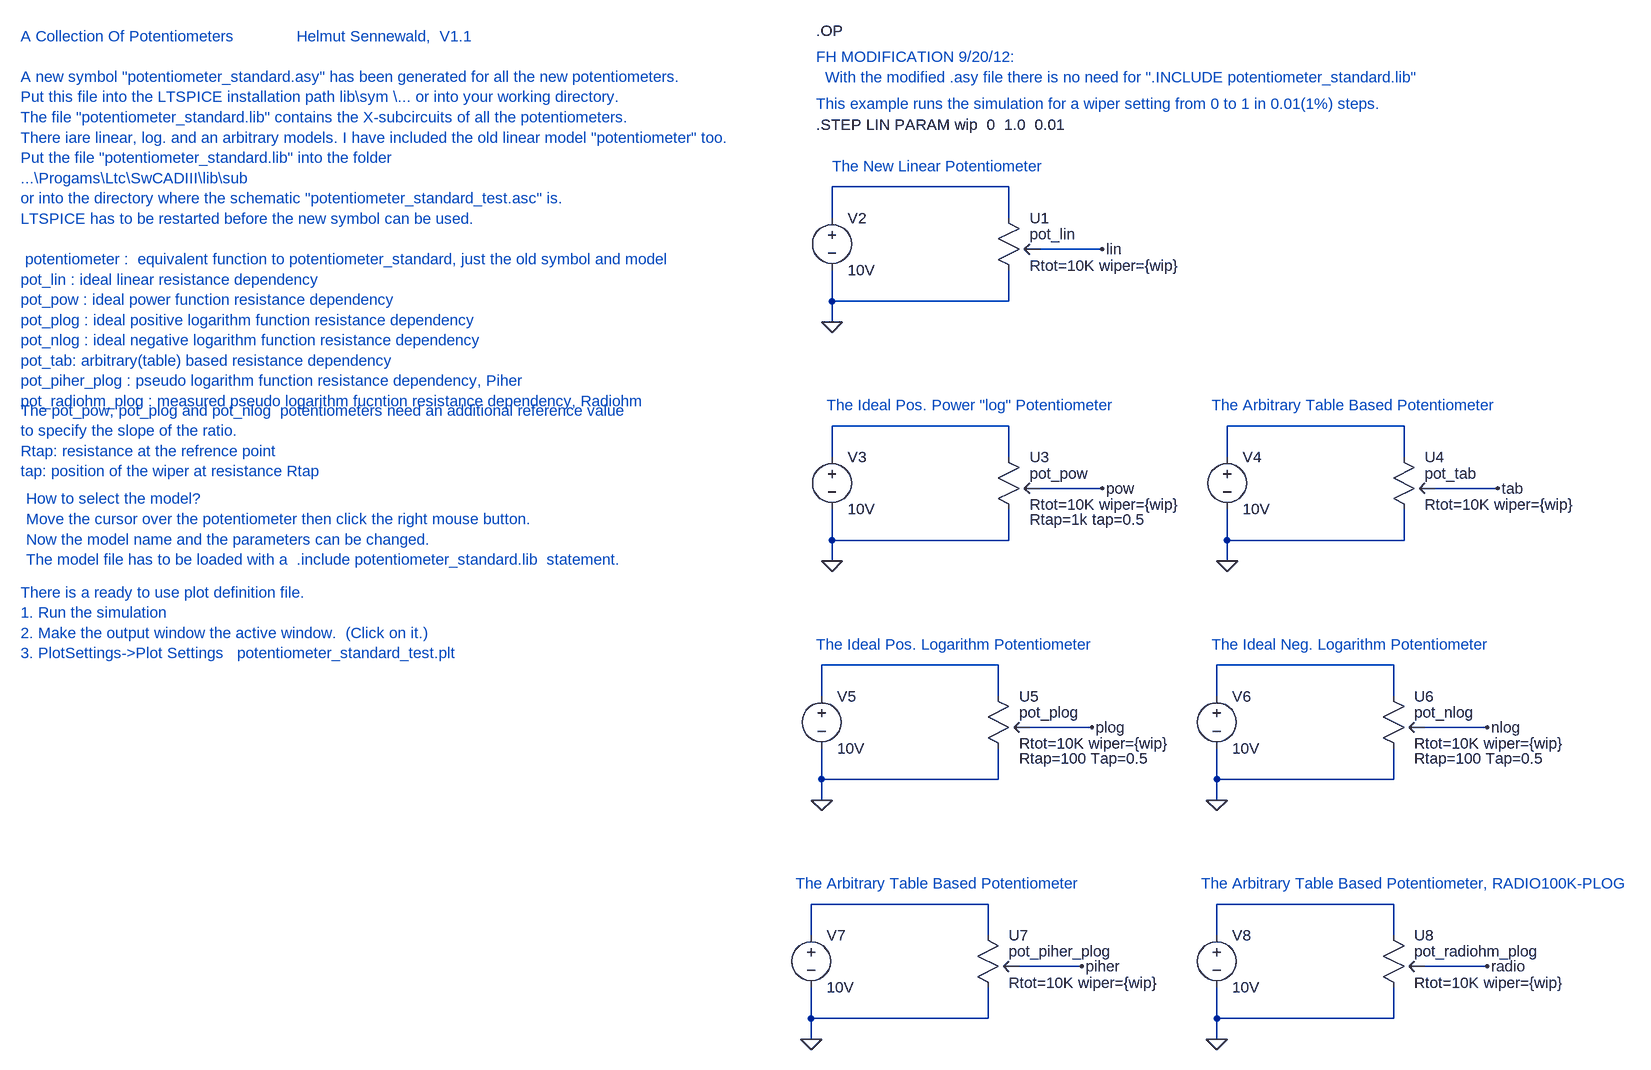
[diagram p0: schematic potentiometer_standard_test.asc]
potentiometer_standard_test.asc, the LTspice schematic file:
Version 4
SHEET 1 2288 3124
WIRE 384 1792 112 1792
WIRE 112 1840 112 1792
WIRE 384 1840 384 1792
WIRE 528 1888 432 1888
WIRE 112 1968 112 1920
WIRE 384 1968 384 1920
WIRE 384 1968 112 1968
WIRE 112 2000 112 1968
WIRE 384 2160 112 2160
WIRE 992 2160 720 2160
WIRE 112 2208 112 2160
WIRE 384 2208 384 2160
WIRE 720 2208 720 2160
WIRE 992 2208 992 2160
WIRE 528 2256 432 2256
WIRE 1136 2256 1040 2256
WIRE 112 2336 112 2288
WIRE 384 2336 384 2288
WIRE 384 2336 112 2336
WIRE 720 2336 720 2288
WIRE 992 2336 992 2288
WIRE 992 2336 720 2336
WIRE 112 2368 112 2336
WIRE 720 2368 720 2336
WIRE 368 2528 96 2528
WIRE 976 2528 704 2528
WIRE 96 2576 96 2528
WIRE 368 2576 368 2528
WIRE 704 2576 704 2528
WIRE 976 2576 976 2528
WIRE 512 2624 416 2624
WIRE 1120 2624 1024 2624
WIRE 96 2704 96 2656
WIRE 368 2704 368 2656
WIRE 368 2704 96 2704
WIRE 704 2704 704 2656
WIRE 976 2704 976 2656
WIRE 976 2704 704 2704
WIRE 96 2736 96 2704
WIRE 704 2736 704 2704
WIRE 352 2896 80 2896
WIRE 976 2896 704 2896
WIRE 80 2944 80 2896
WIRE 352 2944 352 2896
WIRE 704 2944 704 2896
WIRE 976 2944 976 2896
WIRE 496 2992 400 2992
WIRE 1120 2992 1024 2992
WIRE 80 3072 80 3024
WIRE 352 3072 352 3024
WIRE 352 3072 80 3072
WIRE 704 3072 704 3024
WIRE 976 3072 976 3024
WIRE 976 3072 704 3072
WIRE 80 3104 80 3072
WIRE 704 3104 704 3072
FLAG 528 1888 lin
FLAG 112 2000 0
FLAG 528 2256 pow
FLAG 112 2368 0
FLAG 1136 2256 tab
FLAG 720 2368 0
FLAG 512 2624 plog
FLAG 96 2736 0
FLAG 1120 2624 nlog
FLAG 704 2736 0
FLAG 496 2992 piher
FLAG 80 3104 0
FLAG 1120 2992 radio
FLAG 704 3104 0
SYMBOL VOLTAGE 112 1824 R0
SYMATTR InstName V2
SYMATTR Value 10V
SYMBOL VOLTAGE 112 2192 R0
SYMATTR InstName V3
SYMATTR Value 10V
SYMBOL VOLTAGE 720 2192 R0
SYMATTR InstName V4
SYMATTR Value 10V
SYMBOL VOLTAGE 96 2560 R0
SYMATTR InstName V5
SYMATTR Value 10V
SYMBOL VOLTAGE 704 2560 R0
SYMATTR InstName V6
SYMATTR Value 10V
SYMBOL VOLTAGE 80 2928 R0
SYMATTR InstName V7
SYMATTR Value 10V
SYMBOL VOLTAGE 704 2928 R0
SYMATTR InstName V8
SYMATTR Value 10V
SYMBOL potentiometer_standard 368 1824 R0
SYMATTR InstName U1
SYMATTR Value Rtot=10K wiper={wip}
SYMATTR SpiceLine ""
SYMBOL potentiometer_standard 368 2192 R0
SYMATTR InstName U3
SYMATTR Value Rtot=10K wiper={wip}
SYMATTR SpiceModel pot_pow
SYMBOL potentiometer_standard 976 2192 R0
SYMATTR InstName U4
SYMATTR Value Rtot=10K wiper={wip}
SYMATTR SpiceLine ""
SYMATTR SpiceModel pot_tab
SYMBOL potentiometer_standard 352 2560 R0
SYMATTR InstName U5
SYMATTR Value Rtot=10K wiper={wip}
SYMATTR SpiceLine Rtap=100 Tap=0.5
SYMATTR SpiceModel pot_plog
SYMBOL potentiometer_standard 960 2560 R0
SYMATTR InstName U6
SYMATTR Value Rtot=10K wiper={wip}
SYMATTR SpiceLine Rtap=100 Tap=0.5
SYMATTR SpiceModel pot_nlog
SYMBOL potentiometer_standard 336 2928 R0
SYMATTR InstName U7
SYMATTR Value Rtot=10K wiper={wip}
SYMATTR SpiceLine ""
SYMATTR SpiceModel pot_piher_plog
SYMBOL potentiometer_standard 960 2928 R0
SYMATTR InstName U8
SYMATTR Value Rtot=10K wiper={wip}
SYMATTR SpiceLine ""
SYMATTR SpiceModel pot_radiohm_plog
TEXT 88 1552 Left 2 !.OP
TEXT 88 1592 Left 2 ;FH MODIFICATION 9/20/12:\n  With the modified .asy file there is no need for ".INCLUDE potentiometer_standard.lib"
TEXT -1136 1560 Left 2 ;A Collection Of Potentiometers              Helmut Sennewald,  V1.1\n \nA new symbol "potentiometer_standard.asy" has been generated for all the new potentiometers.\nPut this file into the LTSPICE installation path lib\\sym \\... or into your working directory.\nThe file "potentiometer_standard.lib" contains the X-subcircuits of all the potentiometers.\nThere iare linear, log. and an arbitrary models. I have included the old linear model "potentiometer" too.\nPut the file "potentiometer_standard.lib" into the folder \n...\\Progams\\Ltc\\SwCADIII\\lib\\sub\nor into the directory where the schematic "potentiometer_standard_test.asc" is. \nLTSPICE has to be restarted before the new symbol can be used.\n \n potentiometer :  equivalent function to potentiometer_standard, just the old symbol and model\npot_lin : ideal linear resistance dependency\npot_pow : ideal power function resistance dependency\npot_plog : ideal positive logarithm function resistance dependency\npot_nlog : ideal negative logarithm function resistance dependency\npot_tab: arbitrary(table) based resistance dependency\npot_piher_plog : pseudo logarithm function resistance dependency, Piher\npot_radiohm_plog : measured pseudo logarithm fucntion resistance dependency, Radiohm
TEXT 88 1664 Left 2 ;This example runs the simulation for a wiper setting from 0 to 1 in 0.01(1%) steps.
TEXT 88 1696 Left 2 !.STEP LIN PARAM wip  0  1.0  0.01
TEXT 112 1760 Left 2 ;The New Linear Potentiometer
TEXT 104 2128 Left 2 ;The Ideal Pos. Power "log" Potentiometer
TEXT 696 2128 Left 2 ;The Arbitrary Table Based Potentiometer
TEXT -1128 2272 Left 2 ;How to select the model?\nMove the cursor over the potentiometer then click the right mouse button. \nNow the model name and the parameters can be changed. \nThe model file has to be loaded with a  .include potentiometer_standard.lib  statement.
TEXT 88 2496 Left 2 ;The Ideal Pos. Logarithm Potentiometer
TEXT 696 2496 Left 2 ;The Ideal Neg. Logarithm Potentiometer
TEXT 56 2864 Left 2 ;The Arbitrary Table Based Potentiometer
TEXT 680 2864 Left 2 ;The Arbitrary Table Based Potentiometer, RADIO100K-PLOG
TEXT -1136 2136 Left 2 ;The pot_pow, pot_plog and pot_nlog  potentiometers need an additional reference value \nto specify the slope of the ratio.\nRtap: resistance at the refrence point\ntap: position of the wiper at resistance Rtap
TEXT -1136 2416 Left 2 ;There is a ready to use plot definition file.\n1. Run the simulation\n2. Make the output window the active window.  (Click on it.)\n3. PlotSettings->Plot Settings   potentiometer_standard_test.plt

The netlist it stands for:
* potentiometer_standard_test.asc
V2 N001 0 10V
V3 N002 0 10V
V4 N003 0 10V
V5 N004 0 10V
V6 N005 0 10V
V7 N006 0 10V
V8 N007 0 10V
XU1 N001 0 lin pot_lin Rtot=10K wiper={wip}  ; pins A B C
XU3 N002 0 pow pot_pow Rtot=10K wiper={wip} Rtap=1k tap=0.5  ; pins A B C
XU4 N003 0 tab pot_tab Rtot=10K wiper={wip}  ; pins A B C
XU5 N004 0 plog pot_plog Rtot=10K wiper={wip} Rtap=100 Tap=0.5  ; pins A B C
XU6 N005 0 nlog pot_nlog Rtot=10K wiper={wip} Rtap=100 Tap=0.5  ; pins A B C
XU7 N006 0 piher pot_piher_plog Rtot=10K wiper={wip}  ; pins A B C
XU8 N007 0 radio pot_radiohm_plog Rtot=10K wiper={wip}  ; pins A B C
.OP
* FH MODIFICATION 9/20/12:
*   With the modified .asy file there is no need for ".INCLUDE potentiometer_standard.lib"
* A Collection Of Potentiometers              Helmut Sennewald,  V1.1
* A new symbol "potentiometer_standard.asy" has been generated for all the new potentiometers.
* Put this file into the LTSPICE installation path lib\sym \... or into your working directory.
* The file "potentiometer_standard.lib" contains the X-subcircuits of all the potentiometers.
* There iare linear, log. and an arbitrary models. I have included the old linear model "potentiometer" too.
* Put the file "potentiometer_standard.lib" into the folder
* ...\Progams\Ltc\SwCADIII\lib\sub
* or into the directory where the schematic "potentiometer_standard_test.asc" is.
* LTSPICE has to be restarted before the new symbol can be used.
*  potentiometer :  equivalent function to potentiometer_standard, just the old symbol and model
* pot_lin : ideal linear resistance dependency
* pot_pow : ideal power function resistance dependency
* pot_plog : ideal positive logarithm function resistance dependency
* pot_nlog : ideal negative logarithm function resistance dependency
* pot_tab: arbitrary(table) based resistance dependency
* pot_piher_plog : pseudo logarithm function resistance dependency, Piher
* pot_radiohm_plog : measured pseudo logarithm fucntion resistance dependency, Radiohm
* This example runs the simulation for a wiper setting from 0 to 1 in 0.01(1%) steps.
.STEP LIN PARAM wip  0  1.0  0.01
* The New Linear Potentiometer
* The Ideal Pos. Power "log" Potentiometer
* The Arbitrary Table Based Potentiometer
* How to select the model?
* Move the cursor over the potentiometer then click the right mouse button.
* Now the model name and the parameters can be changed.
* The model file has to be loaded with a  .include potentiometer_standard.lib  statement.
* The Ideal Pos. Logarithm Potentiometer
* The Ideal Neg. Logarithm Potentiometer
* The Arbitrary Table Based Potentiometer
* The Arbitrary Table Based Potentiometer, RADIO100K-PLOG
* The pot_pow, pot_plog and pot_nlog  potentiometers need an additional reference value
* to specify the slope of the ratio.
* Rtap: resistance at the refrence point
* tap: position of the wiper at resistance Rtap
* There is a ready to use plot definition file.
* 1. Run the simulation
* 2. Make the output window the active window.  (Click on it.)
* 3. PlotSettings->Plot Settings   potentiometer_standard_test.plt
.lib potentiometer_standard.lib
.backanno
.end